# EAGLE design esp (EAGLE 7.1.0)
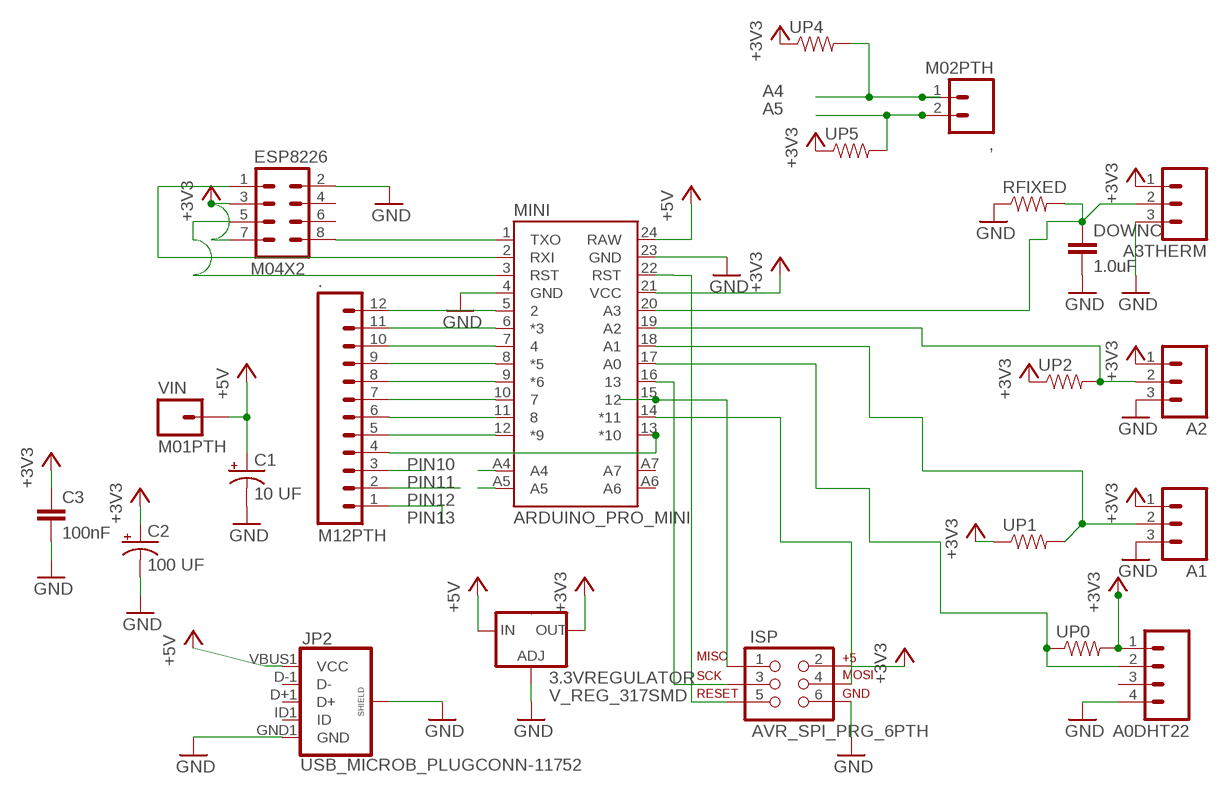
[diagram p0: schematic, sheet 1]

## Parts
3.3VREGULATOR  V_REG_317SMD  [SOT223]
,  M02PTH  [1X02]
.  M12PTH  [1X12]
A0DHT22  M04PTH  [1X04]
A1  M03PTH  [1X03]
A2  M03PTH  [1X03]
A3THERM  M03PTH  [1X03]
C1  10 UF  10UF-25V-20%(PTH)  [CPOL-RADIAL-10UF-25V]
C2  100 UF  10UF-25V-20%(PTH)  [CPOL-RADIAL-10UF-25V]
C3  100nF  1.0UF-25V-+80/-20(0805)  [0805]
DOWNC  1.0uF  1.0UF-25V-+80/-20(0805)  [0805]
ESP8226  M04X2  [2X4]
ISP  AVR_SPI_PRG_6PTH  [2X3]
JP2  USB_MICROB_PLUGCONN-11752  [USB-B-MICRO-SMD_V03]
MINI  ARDUINO_PRO_MINI  [ARDUINO_PRO_MINI]
RFIXED  0.3OHM-1/8W-1%(0805)  [0805]
UP0  0.3OHM-1/8W-1%(0805)  [0805]
UP1  0.3OHM-1/8W-1%(0805)  [0805]
UP2  0.3OHM-1/8W-1%(0805)  [0805]
UP4  0.3OHM-1/8W-1%(0805)  [0805]
UP5  0.3OHM-1/8W-1%(0805)  [0805]
VIN  M01PTH  [1X01]

## Nets
+3V3: 3.3VREGULATOR.2(OUT) A0DHT22.1 A1.1 A2.1 A3THERM.1 C2.1(+) C3.1 ESP8226.3 ESP8226.7 ISP.2 MINI.21(VCC) UP0.2 UP1.1 UP2.1 UP4.1 UP5.1
+5V: 3.3VREGULATOR.3(IN) C1.1(+) JP2.VBUS1(VCC) MINI.24(RAW) VIN.1
A4: ,.1 MINI.A4 UP4.2
A5: ,.2 MINI.A5 UP5.2
GND: 3.3VREGULATOR.1(ADJ) A0DHT22.4 A1.3 A2.3 A3THERM.3 C1.2(-) C2.2(-) C3.2 DOWNC.2 ESP8226.2 ISP.6 JP2.GND1(GND) JP2.SHIELD1(SHIELD) JP2.SHIELD2(SHIELD) JP2.SHIELD3(SHIELD) MINI.4(GND) MINI.23(GND) RFIXED.1
N$1: ESP8226.1 MINI.2(RXI)
N$2: ESP8226.8 MINI.1(TXO)
N$3: A2.2 MINI.19(A2) UP2.2
N$4: A3THERM.2 DOWNC.1 MINI.20(A3) RFIXED.2
N$7: ..12 MINI.5
N$8: A0DHT22.2 MINI.17(A0) UP0.1
N$10: ..11 MINI.6(*3)
N$11: ..10 MINI.7
N$12: ..9 MINI.8(*5)
N$13: ..8 MINI.9(*6)
N$14: ..7 MINI.10
N$15: ..6 MINI.11
N$16: ..5 MINI.12(*9)
N$18: ESP8226.5 MINI.3(RST)
N$19: A1.2 MINI.18(A1) UP1.2
PIN10: ..4 MINI.13(*10)
PIN11: ..3 ISP.4 MINI.14(*11)
PIN12: ..2 ISP.1 MINI.15
PIN13: ..1 ISP.3 MINI.16
RST: ISP.5 MINI.22(RST)
Unconnected: A0DHT22.3 ESP8226.4 ESP8226.6 JP2.D+1(D+) JP2.D-1(D-) JP2.ID1(ID) MINI.A6 MINI.A7

## Library data of the parts
3.3VREGULATOR = SparkFun-PowerIC:V_REG_317: Voltage Regulator Standard LM317 adjustable voltage regulator. AOI (Adjust Output Input). Google 'LM317 Calculator' for easy to use app to get the two resistor values needed. 240/720 for 5V output. 240/390 for 3.3V output. Spark Fun Electronics SKU : COM-00527
, = SparkFun-Connectors:M02: Standard 2-pin 0.1" header. Use with - straight break away headers ( PRT-00116) - right angle break away headers (PRT-00553) - swiss pins (PRT-00743) - machine pins (PRT-00117) - female headers (PRT-00115) Molex polarized connector foot print use with: PRT-08233 with associated crimp pins and housings. 2.54_SCREWTERM for use with PRT-10571. 3.5mm Screw Terminal footprints for PRT-08084 5mm Screw Terminal footprints for use with PRT-08432
. = SparkFun-Connectors:M12: Header 12 Standard 12-pin 0.1" header. Use with straight break away headers (SKU : PRT-00116), right angle break away headers (PRT-00553), swiss pins (PRT-00743), machine pins (PRT-00117), and female headers (PRT-00115).
A0DHT22 = SparkFun-Connectors:M04: Header 4 Standard 4-pin 0.1" header. Use with straight break away headers (SKU : PRT-00116), right angle break away headers (PRT-00553), swiss pins (PRT-00743), machine pins (PRT-00117), and female headers (PRT-00115). Molex polarized connector foot print use with SKU : PRT-08231 with associated crimp pins and housings. 1MM SMD Version SKU: PRT-10208
A1 A2 A3THERM = SparkFun-Connectors:M03: Header 3 Standard 3-pin 0.1" header. Use with straight break away headers (SKU : PRT-00116), right angle break away headers (PRT-00553), swiss pins (PRT-00743), machine pins (PRT-00117), and female headers (PRT-00115). Molex polarized connector foot print use with SKU : PRT-08232 with associated crimp pins and housings.
C1 C2 = SparkFun-Capacitors:10UF-25V-20%(PTH): CAP-08440; PROD_ID: CAP-08440
C3 = SparkFun-Capacitors:1.0UF-25V-+80/-20(0805): CAP-11625; PROD_ID: CAP-11625; VALUE: 1.0uF
DOWNC = SparkFun-Capacitors:1.0UF-25V-+80/-20(0805): CAP-11625; PROD_ID: CAP-11625
ESP8226 = SparkFun-Connectors:M04X2: .1" header, two rows of four.
ISP = SparkFun-Connectors:AVR_SPI_PRG_6: AVR ISP 6 Pin This is the reduced ISP connector for AVR programming. Common on Arduino. This footprint will take up less PCB space and can be used with a 10-pin to 6-pin adapter such as SKU: BOB-08508 **Special note about "TEST_POINT" package. The stop mask is on the top side, so if you want your programming test points to be on the bottom of your board, make sure to place this package on the bottom side of the board. This also ensure that the orientation to program from the bottom side will be correct.
JP2 = SparkFun-Connectors:USB_MICROB_PLUG: USB Micro-B connectors Some male, some female. Watch your step!; PROD_ID: CONN-11752
MINI = SparkFun-Boards:ARDUINO_PRO_MINI
RFIXED UP0 UP1 UP2 UP4 UP5 = SparkFun-Resistors:0.3OHM-1/8W-1%(0805): RES-11622; PROD_ID: RES-11622; VALUE: 0.3
VIN = SparkFun-Connectors:M01: Header 1 Standard 1-pin 0.1" header. Use with straight break away headers (SKU : PRT-00116), right angle break away headers (PRT-00553), swiss pins (PRT-00743), machine pins (PRT-00117), and female headers (PRT-00115).

## Board
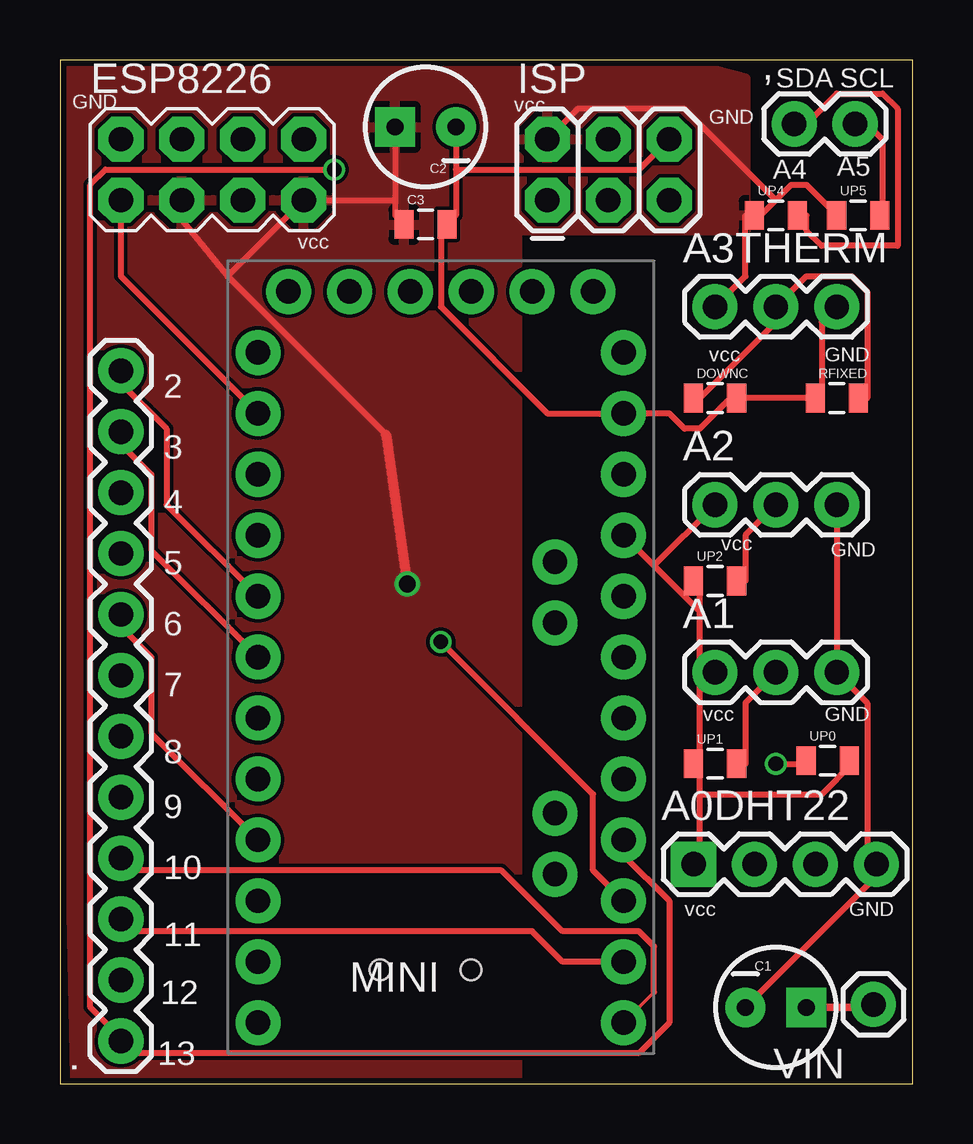
[diagram p1: board, top side]
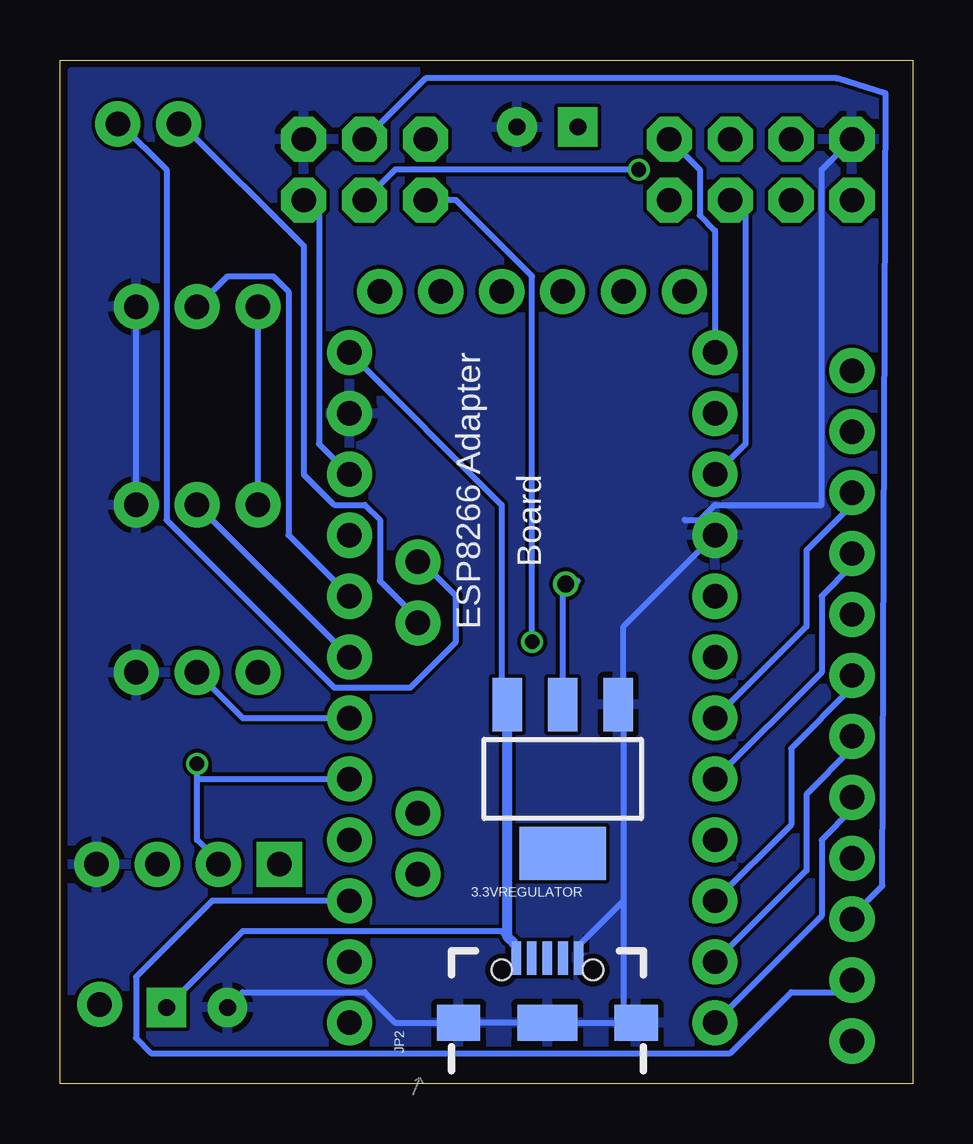
[diagram p2: board, bottom side, seen from below]

Size 35.56 x 42.67 mm. Coordinates in mm from the lower left corner, seen from the top.
Outline: 0,0 35.56,0 35.56,42.67 0,42.67 0,0
Copper layers (1*16): Top 0.035mm / dielectric 1.5mm / Bottom 0.035mm
Design rules "SeeedStudio_2layer_DRU_no_angle_20140221": minimum track width 6mil, minimum drill 12mil, track to track 6mil, track to pad 6mil, pad to pad 6mil, via to via 6mil, smd to smd 0mil, copper to edge 10mil, drill to drill 10mil, minimum pad ring 10mil, minimum via ring 6mil, stop-mask expansion 2mil, vias tented up to drill 100mil, thermal gap 10mil

### Footprints (pad centres in the part's own frame; a part is rotated, then mirrored left to right if it is on the bottom)
SOT223 = smd 1.219 x 2.235: 1 -2.311,-3.099; 2 0,-3.099; 3 2.311,-3.099 | smd 3.6 x 2.2: 4 0,3.099
1X02 = drill 1.016 pad 1.88: 1 0,0; 2 2.54,0
1X12 = drill 1.016 pad 1.88: 1 0,0; 2 2.54,0; 3 5.08,0; 4 7.62,0; 5 10.16,0; 6 12.7,0; 7 15.24,0; 8 17.78,0; 9 20.32,0; 10 22.86,0; 11 25.4,0; 12 27.94,0
1X04 = drill 1.016 pad 1.88 square: 1 0,0 | drill 1.016 pad 1.88: 2 2.54,0; 3 5.08,0; 4 7.62,0
1X03 = drill 1.016 pad 1.88: 1 0,0; 2 2.54,0; 3 5.08,0
CPOL-RADIAL-10UF-25V = drill 0.7 pad 1.651 square: 1 1.27,0 | drill 0.7 pad 1.651: 2 -1.27,0
0805 = smd 0.8 x 1.2: 1 -0.9,0; 2 0.9,0
2X4 = drill 1.016 pad 1.88 octagon: 1 -3.81,-1.27; 2 -3.81,1.27; 3 -1.27,-1.27; 4 -1.27,1.27; 5 1.27,-1.27; 6 1.27,1.27; 7 3.81,-1.27; 8 3.81,1.27
2X3 = drill 1.016 pad 1.88 octagon: 1 0,0; 2 0,2.54; 3 2.54,0; 4 2.54,2.54; 5 5.08,0; 6 5.08,2.54
USB-B-MICRO-SMD_V03 = smd 1.4 x 0.4: D+1 2.7,0; D-1 2.7,0.65; GND1 2.7,-1.3; ID1 2.7,-0.65; VBUS1 2.7,1.3 | smd 1.5 x 1.8: SHIELD1 0,3.7; SHIELD2 0,-3.7 | smd 1.5 x 2.5: SHIELD3 0,0 | hole 0.85: 2.2,1.9; 2.2,-1.9
ARDUINO_PRO_MINI = drill 1.016 pad 1.88: 1 -7.62,12.7; 2 -7.62,10.16; 3 -7.62,7.62; 4 -7.62,5.08; 5 -7.62,2.54; 6 -7.62,0; 7 -7.62,-2.54; 8 -7.62,-5.08; 9 -7.62,-7.62; 10 -7.62,-10.16; 11 -7.62,-12.7; 12 -7.62,-15.24; 13 7.62,-15.24; 14 7.62,-12.7; 15 7.62,-10.16; 16 7.62,-7.62; 17 7.62,-5.08; 18 7.62,-2.54; 19 7.62,0; 20 7.62,2.54; 21 7.62,5.08; 22 7.62,7.62; 23 7.62,10.16; 24 7.62,12.7; A4 4.763,1.429; A5 4.763,3.969; A6 4.763,-9.049; A7 4.763,-6.509; BLK -6.35,15.24; GND -3.81,15.24; GRN 6.35,15.24; RXI 1.27,15.24; TXO 3.81,15.24; VCC -1.27,15.24
1X01 = drill 1.016 pad 1.88: 1 0,0

### Placement (x,y rotation side)
3.3VREGULATOR  14.61,12.7 180 bottom
,  30.61,40.01 0 top
.  2.54,1.78 90 top
A0DHT22  26.42,9.14 0 top
A1  27.3,17.14 0 top
A2  27.3,24.13 0 top
A3THERM  27.3,32.38 0 top
C1  29.84,3.17 0 top
C2  15.24,39.88 180 top
C3  15.24,35.81 0 top
DOWNC  27.3,28.57 0 top
ESP8226  6.35,38.1 0 top
ISP  20.32,36.83 0 top
JP2  15.24,2.54 90 bottom
MINI  15.88,17.78 0 top
RFIXED  32.38,28.57 0 top
UP0  32,13.46 0 top
UP1  27.3,13.34 0 top
UP2  27.3,20.95 0 top
UP4  29.84,36.2 0 top
UP5  33.27,36.2 0 top
VIN  33.91,3.3 180 top

### Tracks (layer width: path | path; a pad name or v marks a point on that pad's centre or on a via)
+3V3  (via drill 0.7)
  Top 0.254: 6.99,33.66 4.99,36.12 5.08,36.2 ESP8226.3 | 6.99,33.66 13.59,27.05 | C2.1 13.97,36.83 | 13.97,36.83 13.97,36.2 C3.1 | 6.99,33.66 ESP8226.7 13.97,36.83 | A3THERM.1 28.57,33.66 28.57,36.2 UP4.1 29.21,36.2 29.84,36.83 | 29.84,36.83 30.48,37.47 31.11,37.47 32.38,36.2 UP5.1 | ISP.2 21.59,40.64 26.04,40.64 29.84,36.83 | 26.67,12.06 26.67,9.53 A0DHT22.1 | 26.67,12.06 26.67,13.34 | 26.67,12.06 31.75,12.06 33.02,13.34 UP0.2 | 26.67,13.34 26.67,17.14 | 26.67,17.14 26.67,19.68 | 26.67,19.68 26.67,20.95 UP2.1 | 26.67,13.34 UP1.1 | 26.67,17.14 A1.1 | 26.67,19.68 24.77,21.59 | 24.77,21.59 MINI.21 | 24.77,21.59 A2.1
  Top 0.406: 13.59,27.05 v14.48,20.83
  Bottom 0.254: 3.3VREGULATOR.2 14.61,20.32 13.97,20.95 v14.48,20.83 | A2.1 A3THERM.1 | 13.97,40.01 C2.1
  pour Top: -0.25,42.42 26.67,42.42 28.57,41.91 28.57,35.56 19.05,35.56 19.05,0.25 0.64,0.25
+5V
  Top 0.254: 33.66,3.17 VIN.1
  Top 0.305: 33.66,3.17 C1.1
  Bottom 0.254: MINI.24 17.14,24.13 17.14,15.88 3.3VREGULATOR.3 | C1.1 27.94,6.35 17.14,6.35 16.64,5.84 16.51,5.71 JP2.VBUS1
  Bottom 0.406: 3.3VREGULATOR.3 16.92,6.12 16.64,5.84
A4
  Top 0.254: UP4.2 31.11,36.2 31.11,35.56 31.75,34.92 34.92,34.92 34.92,40.64 34.29,41.27 32.38,41.27 31.11,40.01 ,.1
  Bottom 0.254: MINI.A4 20.95,19.68 22.23,20.95 22.23,23.5 22.86,24.13 24.13,24.13 25.4,25.4 25.4,34.92 30.48,40.01 ,.1
A5
  Top 0.254: UP5.2 34.29,36.2 34.29,39.37 33.66,40.01 ,.2
  Bottom 0.254: MINI.A5 20.32,21.59 19.05,20.32 19.05,18.41 20.95,16.51 24.13,16.51 31.11,23.5 31.11,38.1 33.02,40.01 ,.2
GND
  Top 0.254: 16.51,38.1 C2.2 16.51,40.01 | 16.51,38.1 16.51,36.2 C3.2 15.88,35.56 15.88,32.38 20.32,27.94 MINI.23 25.4,27.94 26.04,27.3 26.67,27.3 27.94,28.57 DOWNC.2 RFIXED.1 31.75,28.57 31.75,31.75 A3THERM.3 | ISP.6 24.13,38.1 16.51,38.1 | C1.2 34.29,8.89 A0DHT22.4 33.66,9.53 33.66,15.88 A1.3 A2.3
  Bottom 0.254: 12.06,2.54 JP2.SHIELD3 JP2.SHIELD1 21.59,2.54 22.86,3.81 27.94,3.81 C1.2 | 12.06,7.62 13.97,5.71 JP2.GND1 | 12.06,7.62 12.06,15.24 3.3VREGULATOR.1 12.06,15.88 12.06,19.05 MINI.4 | 12.06,7.62 12.06,2.54 | 12.06,2.54 JP2.SHIELD2 | A2.3 A3THERM.3 | ESP8226.2 3.81,38.1 3.81,24.13 8.26,24.13 8.89,23.5 9.53,23.5
  pour Bottom: 0.64,42.16 35.05,42.16 35.05,41.78 35.05,0 0.76,0 0.76,0.38
N$1
  Top 0.254: MINI.2 2.54,33.66 ESP8226.1
N$2
  Bottom 0.254: MINI.1 8.26,35.56 8.89,36.2 8.89,38.1 ESP8226.8
N$3
  Top 0.254: A2.2 28.57,22.86 28.57,20.95 UP2.2
  Bottom 0.254: A2.2 MINI.19
N$4
  Top 0.254: DOWNC.1 26.67,28.57 29.84,31.75 A3THERM.2 31.11,33.66 33.02,33.66 33.66,33.02 33.66,28.57 RFIXED.2
  Bottom 0.254: MINI.20 26.04,22.86 26.04,33.02 26.67,33.66 28.57,33.66 A3THERM.2
N$7
  Top 0.254: MINI.5 4.45,24.13 4.45,27.3 2.54,29.21 ..12
N$8  (via drill 0.61)
  Top 0.254: v29.84,13.34 31.11,13.34 UP0.1
  Bottom 0.254: 29.84,12.7 29.84,10.16 29.21,9.53 A0DHT22.2 | 29.84,12.7 v29.84,13.34 | 29.84,12.7 MINI.17
N$10
  Top 0.254: MINI.6 3.81,22.23 3.81,25.4 2.54,26.67 ..11
N$11
  Bottom 0.254: MINI.7 4.45,19.05 4.45,22.23 2.54,24.13 ..10
N$12
  Bottom 0.254: MINI.8 3.81,17.14 3.81,20.32 2.54,21.59 ..9
N$13
  Top 0.254: MINI.9 3.81,14.61 3.81,17.78 2.54,19.05 ..8
N$14
  Bottom 0.254: MINI.10 5.08,10.79 5.08,13.97 2.54,16.51 ..7
N$15
  Bottom 0.254: MINI.11 4.45,8.89 4.45,12.06 2.54,13.97 ..6
N$16
  Bottom 0.254: MINI.12 3.81,6.99 3.81,10.16 2.54,11.43 ..5
N$18
  Bottom 0.254: MINI.3 6.99,26.67 6.99,36.2 ESP8226.5
N$19
  Top 0.254: A1.2 28.57,15.88 28.57,13.34 UP1.2
  Bottom 0.254: MINI.18 27.94,15.24 A1.2
PIN10
  Top 0.152: 24.77,3.81 MINI.13
  Top 0.254: 24.77,3.81 24.77,5.71 24.13,6.35 20.95,6.35 18.41,8.89 2.54,8.89 ..4
PIN11
  Top 0.254: MINI.14 20.95,5.08 19.68,6.35 2.54,6.35 ..3
  Bottom 0.254: ISP.4 20.32,41.91 3.17,41.91 1.14,41.27 1.27,8.26 2.54,6.99 ..3
PIN12  (via drill 0.61)
  Top 0.254: v15.88,18.41 22.23,12.06 22.23,8.89 MINI.15
  Bottom 0.254: MINI.15 29.21,7.62 32.38,4.45 32.38,1.91 31.75,1.27 7.62,1.27 5.08,3.81 2.54,3.81 ..2 | ISP.1 19.05,36.83 15.88,33.66 v15.88,18.41
PIN13  (via drill 0.61)
  Top 0.254: MINI.16 23.5,9.53 25.4,7.62 25.4,2.54 24.13,1.27 2.54,1.27 ..1 2.54,1.91 1.27,3.17 1.27,37.47 1.91,38.1 v11.43,38.1
  Bottom 0.254: ISP.3 21.59,38.1 v11.43,38.1
RST
  Bottom 0.254: MINI.22 24.77,26.67 24.77,36.2 ISP.5

### Text on the board
tNames: SDA | SCL | GND | vcc | GND | A4 | A5 | vcc | vcc | GND | 2 | 3 | 4 | vcc | GND | 5 | 6 | 7 | vcc | GND | 8 | 9 | 10 | vcc | GND | 11 | 12 | 13
bNames: ESP8266 Adapter | Board